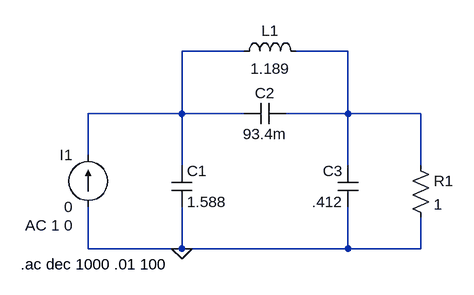
[diagram p0: schematic TS13ej2.asc]
TS13ej2.asc, the LTspice schematic file:
Version 4
SHEET 1 880 680
WIRE 224 -16 128 -16
WIRE 384 -16 304 -16
WIRE 128 80 128 -16
WIRE 128 80 -16 80
WIRE 224 80 128 80
WIRE 384 80 384 -16
WIRE 384 80 288 80
WIRE 496 80 384 80
WIRE -16 144 -16 80
WIRE 128 160 128 80
WIRE 384 160 384 80
WIRE 496 160 496 80
WIRE -16 288 -16 224
WIRE 128 288 128 224
WIRE 128 288 -16 288
WIRE 384 288 384 224
WIRE 384 288 128 288
WIRE 496 288 496 240
WIRE 496 288 384 288
FLAG 128 288 0
SYMBOL current -16 224 R180
WINDOW 0 24 80 Left 2
WINDOW 3 24 0 Left 2
WINDOW 123 24 -28 Left 2
WINDOW 39 0 0 Left 0
SYMATTR InstName I1
SYMATTR Value 0
SYMATTR Value2 AC 1 0
SYMBOL cap 112 160 R0
SYMATTR InstName C1
SYMATTR Value 1.588
SYMBOL cap 288 64 R90
WINDOW 0 0 32 VBottom 2
WINDOW 3 32 32 VTop 2
SYMATTR InstName C2
SYMATTR Value 93.4m
SYMBOL cap 400 224 R180
WINDOW 0 24 56 Left 2
WINDOW 3 24 8 Left 2
SYMATTR InstName C3
SYMATTR Value .412
SYMBOL ind 208 0 R270
WINDOW 0 32 56 VTop 2
WINDOW 3 5 56 VBottom 2
SYMATTR InstName L1
SYMATTR Value 1.189
SYMBOL res 480 144 R0
SYMATTR InstName R1
SYMATTR Value 1
TEXT -120 312 Left 2 !.ac dec 1000 .01 100

The netlist it stands for:
* TS13ej2.asc
I1 0 N001 0 AC 1 0
C1 N001 0 1.588
C2 N002 N001 93.4m
C3 0 N002 .412
L1 N001 N002 1.189
R1 N002 0 1
.ac dec 1000 .01 100
.backanno
.end